# EAGLE schematic pc-bus (EAGLE 9.6.2)
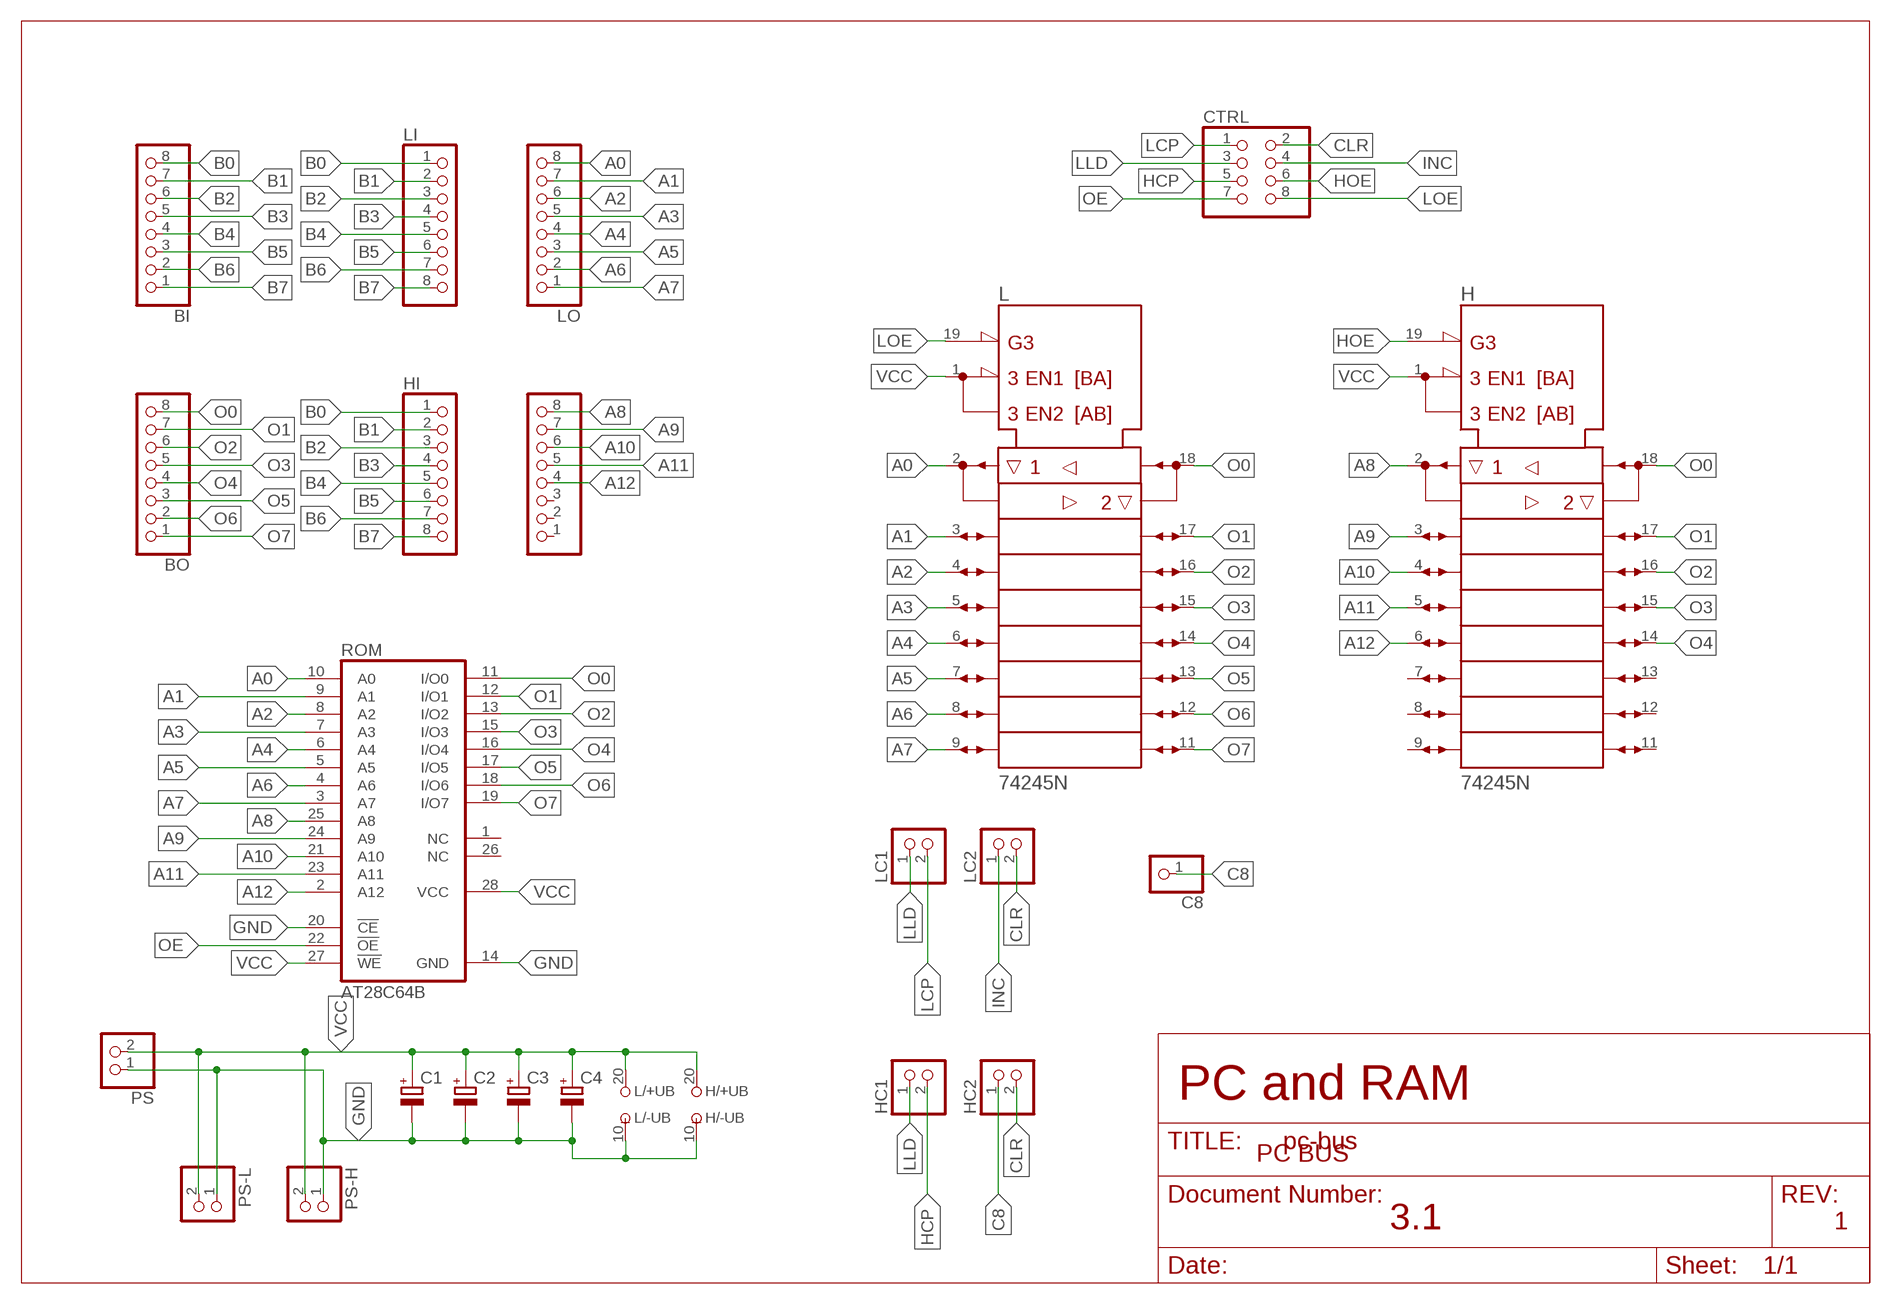
[diagram p0: schematic, sheet 1]

## Parts
BI  PINHD-1X8  [1X08]
BO  PINHD-1X8  [1X08]
C1  CPOL-EUE2.5-6  [E2,5-6]
C2  CPOL-EUE2.5-6  [E2,5-6]
C3  CPOL-EUE2.5-6  [E2,5-6]
C4  CPOL-EUE2.5-6  [E2,5-6]
C8  PINHD-1X1  [1X01]
CTRL  PINHD-2X4  [2X04]
H  74245N  [DIL20]
HC1  PINHD-1X2  [1X02]
HC2  PINHD-1X2  [1X02]
HI  PINHD-1X8  [1X08]
HO  PINHD-1X8  [1X08]
L  74245N  [DIL20]
LC1  PINHD-1X2  [1X02]
LC2  PINHD-1X2  [1X02]
LI  PINHD-1X8  [1X08]
LO  PINHD-1X8  [1X08]
PS  PINHD-1X2  [1X02]
PS-H  PINHD-1X2  [1X02]
PS-L  PINHD-1X2  [1X02]
ROM  AT28C64B  28C64C  [DIL28-6]

## Nets
A0: L.2(A1) LO.8 ROM.10(A0)
A1: L.3(A2) LO.7 ROM.9(A1)
A2: L.4(A3) LO.6 ROM.8(A2)
A3: L.5(A4) LO.5 ROM.7(A3)
A4: L.6(A5) LO.4 ROM.6(A4)
A5: L.7(A6) LO.3 ROM.5(A5)
A6: L.8(A7) LO.2 ROM.4(A6)
A7: L.9(A8) LO.1 ROM.3(A7)
A8: H.2(A1) HO.8 ROM.25(A8)
A9: H.3(A2) HO.7 ROM.24(A9)
A10: H.4(A3) HO.6 ROM.21(A10)
A11: H.5(A4) HO.5 ROM.23(A11)
A12: H.6(A5) HO.4 ROM.2(A12)
B0: BI.8 HI.1 LI.1
B1: BI.7 HI.2 LI.2
B2: BI.6 HI.3 LI.3
B3: BI.5 HI.4 LI.4
B4: BI.4 HI.5 LI.5
B5: BI.3 HI.6 LI.6
B6: BI.2 HI.7 LI.7
B7: BI.1 HI.8 LI.8
C8: C8.1 HC2.1
CLR: CTRL.2 HC2.2 LC2.2
GND: C1.- C2.- C3.- C4.- H.10(-UB) L.10(-UB) PS-H.1 PS-L.1 PS.1 ROM.14(GND) ROM.20(!CE)
HCP: CTRL.5 HC1.2
HOE: CTRL.6 H.19(!G)
INC: CTRL.4 LC2.1
LCP: CTRL.1 LC1.2
LLD: CTRL.3 HC1.1 LC1.1
LOE: CTRL.8 L.19(!G)
O0: BO.8 H.18(B1) L.18(B1) ROM.11(I/O0)
O1: BO.7 H.17(B2) L.17(B2) ROM.12(I/O1)
O2: BO.6 H.16(B3) L.16(B3) ROM.13(I/O2)
O3: BO.5 H.15(B4) L.15(B4) ROM.15(I/O3)
O4: BO.4 H.14(B5) L.14(B5) ROM.16(I/O4)
O5: BO.3 L.13(B6) ROM.17(I/O5)
O6: BO.2 L.12(B7) ROM.18(I/O6)
O7: BO.1 L.11(B8) ROM.19(I/O7)
OE: CTRL.7 ROM.22(!OE)
VCC: C1.+ C2.+ C3.+ C4.+ H.1(DIR) H.20(+UB) L.1(DIR) L.20(+UB) PS-H.2 PS-L.2 PS.2 ROM.27(!WE) ROM.28(VCC)
Unconnected: H.7(A6) H.8(A7) H.9(A8) H.11(B8) H.12(B7) H.13(B6) HO.1 HO.2 HO.3 ROM.1(NC) ROM.26(NC)

## Notes on the sheet
- PC and RAM
- PC BUS
- 3.1 | 1

## Library data of the parts
BI BO HI HO LI LO = pinhead:PINHD-1X8: PIN HEADER
C1-C4 = rcl:CPOL-EU: POLARIZED CAPACITOR, European symbol; SPICEPREFIX: C
C8 = pinhead:PINHD-1X1: PIN HEADER
CTRL = pinhead:PINHD-2X4: PIN HEADER
H L = 74ttl-din:74*245: Octal BUS TRANSCEIVER, 3-state
HC1 HC2 LC1 LC2 PS PS-H PS-L = pinhead:PINHD-1X2: PIN HEADER
ROM = memory-nec:28C64C: MEMORY; MPN: AT28C64B-15PU; OC_FARNELL: 1095784; OC_NEWARK: 96K6557